# EAGLE design power_meter (EAGLE 5.10)
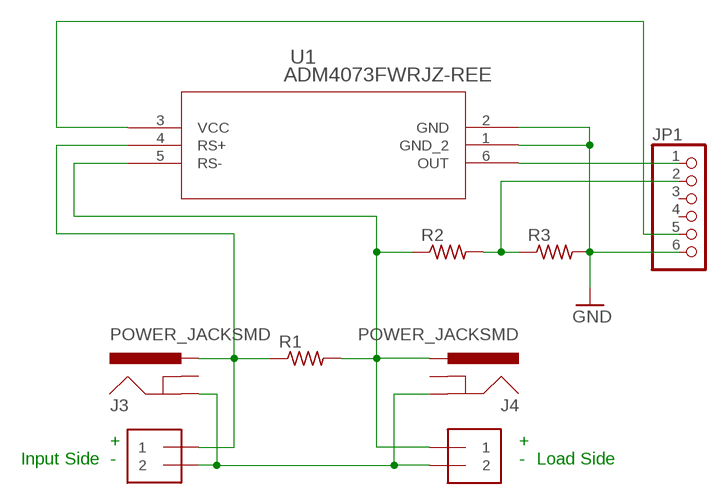
[diagram p0: schematic, sheet 1]

## Parts
J1  1X2-3.5MM  [3.5MMTERM]
J2  1X2-3.5MM  [3.5MMTERM]
J3  POWER_JACKSMD  [POWER_JACK_SMD]
J4  POWER_JACKSMD  [POWER_JACK_SMD]
JP1  PINHD-1X6  [1X06]
R1  R-US_M1206  [M1206]
R2  R-US_M1206  [M1206]
R3  R-US_M1206  [M1206]
U1  ADM4073FWRJZ-REE  [RJ_6]

## Nets
GND: JP1.6 R3.2 U1.1(GND_2) U1.2(GND)
N$1: J2.1 J3.VIN0(PWR) R1.1 U1.4(RS+)
N$2: J1.1 J4.VIN0(PWR) R1.2 R2.1 U1.5(RS-)
N$3: J1.2 J2.2 J3.P$4(GND) J4.P$4(GND)
N$4: JP1.1 U1.6(OUT)
N$5: JP1.2 R2.2 R3.1
N$6: JP1.5 U1.3(VCC)
Unconnected: J3.GND(GNDBREAK) J4.GND(GNDBREAK) JP1.3 JP1.4

## Notes on the sheet
- + | +
- Input Side | - | - | Load Side

## Library data of the parts
J1 J2 = adafruit:1X2: 3.5mm Terminal block http://www.ladyada.net/library/pcb/eaglelibrary.html
J3 J4 = SparkFun:POWER_JACK: Power Jack This is the standard 5.5mm barrel jack for power. The PTH is the most common, proven, reliable, footprint. All others are experimental. The Slot footprint only works if the mill layer is transmitted to the PCB fab house so be warned. Spark Fun Electronics SKU : PRT-00119. Mating wall wart : TOL-00298 (and others)
JP1 = adafruit:PINHD-1X6: PIN HEADER
R1-R3 = resistor:R-US_: RESISTOR, American symbol
U1 = ADM4073:ADM4073FWRJZ-REE

## Board
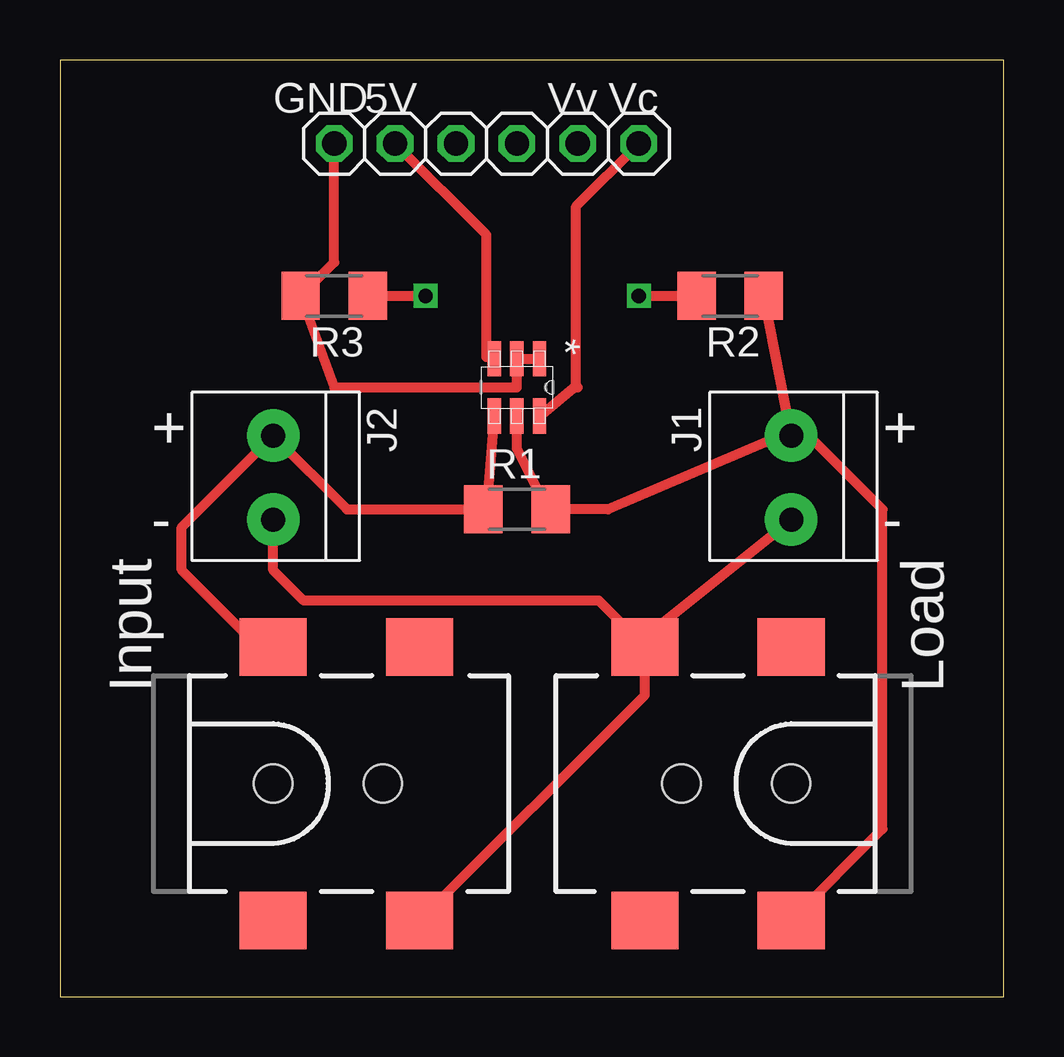
[diagram p1: board, top side]
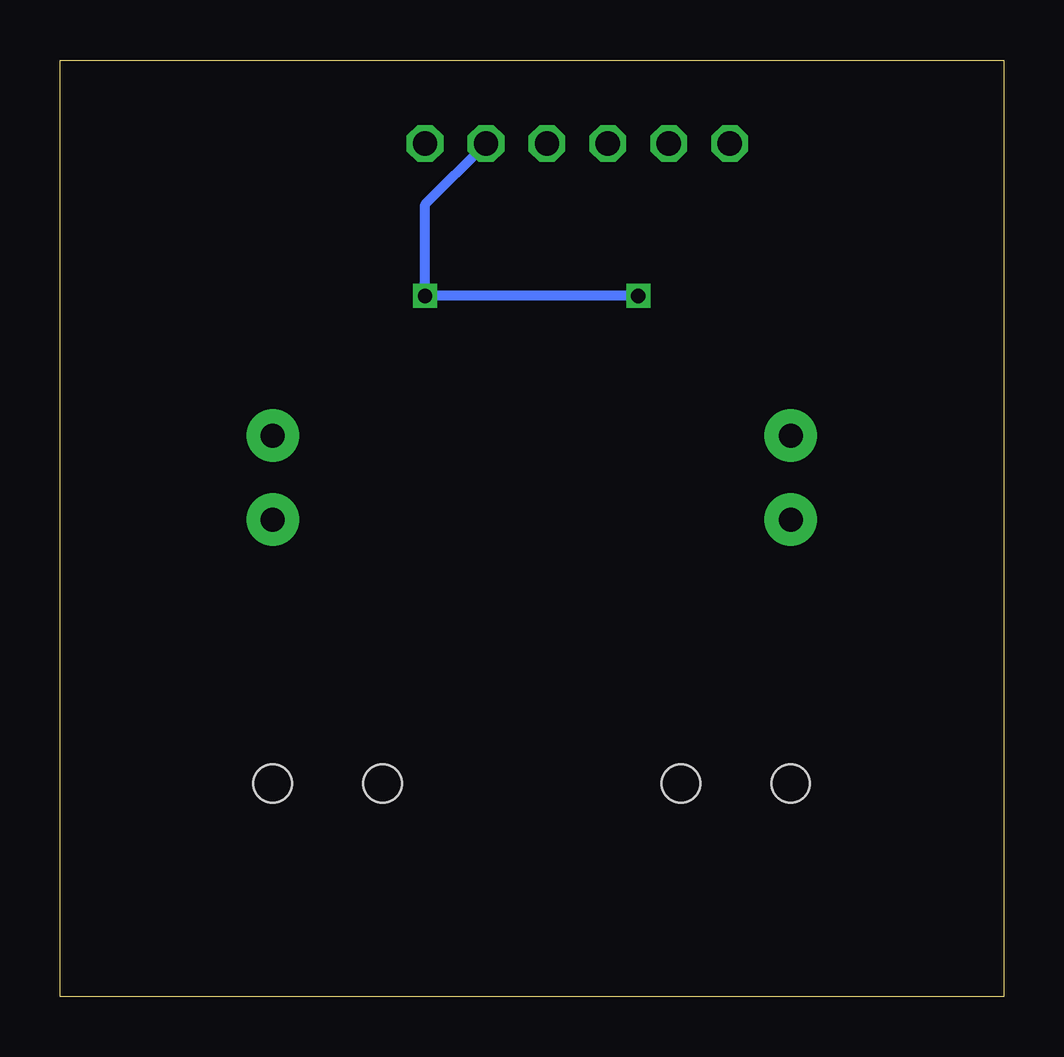
[diagram p2: board, bottom side, seen from below]

Size 39.35 x 39.04 mm. Coordinates in mm from the lower left corner, seen from the top.
Outline: 0,0 39.35,0 39.35,39.04 0,39.04 0,0
Copper layers (1*16): Top 0.035mm / dielectric 1.5mm / Bottom 0.035mm
Design rules "default": minimum track width 10mil, minimum drill 24mil, track to track 8mil, track to pad 8mil, pad to pad 8mil, via to via 8mil, smd to smd 8mil, copper to edge 40mil, drill to drill 8mil, minimum pad ring 10mil, minimum via ring 8mil, stop-mask expansion 4mil, vias tented up to drill 0mil, thermal gap 10mil

### Footprints (pad centres in the part's own frame; a part is rotated, then mirrored left to right if it is on the bottom)
3.5MMTERM = drill 1 pad 2.184 round: 1 1.8,0; 2 -1.7,0
POWER_JACK_SMD = smd 2.8 x 2.4: GND 0,-5.7; P$4 6.1,-5.7; VIN0 0,5.7; VIN1 6.1,5.7 | hole 1.6: 0,0; 4.572,0
1X06 = drill 1.016 octagon: 1 -6.35,0; 2 -3.81,0; 3 -1.27,0; 4 1.27,0; 5 3.81,0; 6 6.35,0
M1206 = smd 1.6 x 2: 1 -1.4,0; 2 1.4,0
RJ_6 = smd 1.473 x 0.559: 1 -1.194,0.94; 2 -1.194,0; 3 -1.194,-0.94; 4 1.194,-0.94; 5 1.194,0; 6 1.194,0.94

### Placement (x,y rotation side)
J1  30.48,21.59 90 top
J2  8.89,21.59 90 top
J3  8.89,8.89 0 top
J4  30.48,8.89 180 top
JP1  17.78,35.56 180 top
R1  19.05,20.32 0 top
R2  27.94,29.21 180 top
R3  11.43,29.21 180 top
U1  19.05,25.4 270 top

### Tracks (layer width: path | path; a pad name or v marks a point on that pad's centre or on a via)
GND
  Top 0.406: U1.1 U1.2 19.05,25.4 11.43,25.4 R3.2 11.43,30.61 JP1.6
N$1
  Top 0.406: J3.VIN0 8.27,14.59 5.08,17.78 5.08,19.58 J2.1 11.96,20.32 R1.1 17.78,20.07 U1.4
N$2
  Top 0.406: J1.1 31.22,23.39 34.29,20.32 34.29,7 J4.VIN0 | J1.1 R2.1 | J1.1 29.48,23.12 22.86,20.32 R1.2 20.32,20.32 19.05,22.86 U1.5
N$3
  Top 0.406: J4.P$4 24.38,12.58 J3.P$4 | J4.P$4 24.38,14.22 24.13,13.97 24.13,14.81 J1.2 | J2.2 8.89,17.78 10.16,16.51 22.46,16.51 J4.P$4
N$4
  Top 0.406: U1.6 21.51,25.48 | 21.51,25.48 21.59,25.4 | 21.51,25.48 21.51,32.94 JP1.1
N$5  (via drill 0.6)
  Top 0.406: v24.13,29.21 R2.2 | R3.1 v15.24,29.21
  Bottom 0.406: v15.24,29.21 v24.13,29.21 24.13,33.02 JP1.2
N$6
  Top 0.406: JP1.5 17.78,31.75 17.78,26.67 18.03,26.67 U1.3

### Text on the board
tPlace: GND | 5V | Vv | Vc | + | + | - | - | Input | Load